# Altium schematic sheet Wifi_Module.SchDoc: Módulo Wifi RN1810
size A4; Author: **; CompanyName: Introducción al Diseño de Circuitos Impresos; Organization: UTN FRBA; DocumentNumber: 6; Revision: 01; SheetNumber: 6; SheetTotal: 9; Autor: Eugenia Ipar
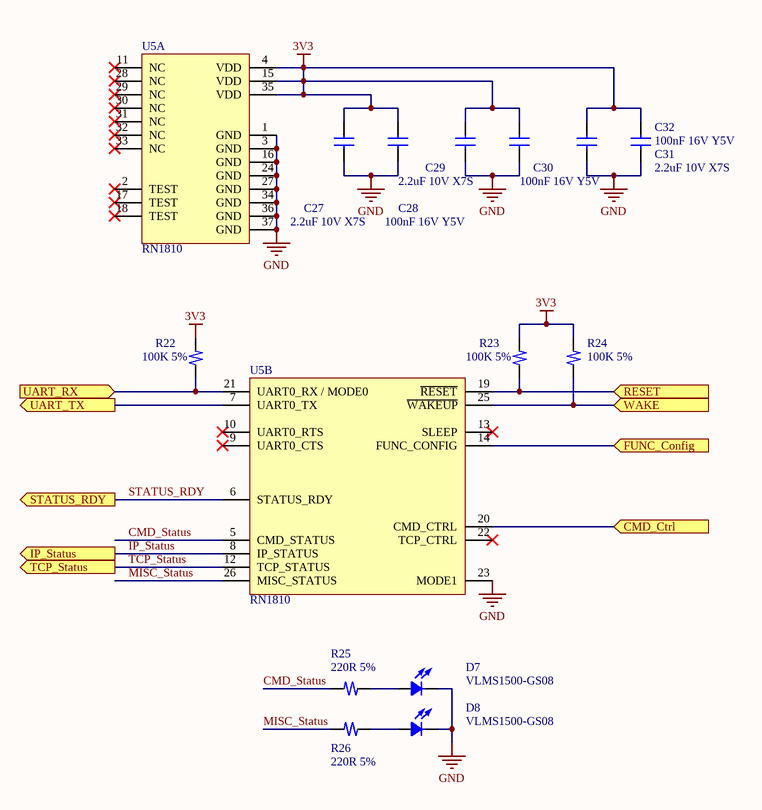
[diagram p0: Wifi_Module.SchDoc]

## Parts
C27  2.2uF 10V X7S  [C_0402]
C28  100nF 16V Y5V  [C_0402]
C29  2.2uF 10V X7S  [C_0402]
C30  100nF 16V Y5V  [C_0402]
C31  2.2uF 10V X7S  [C_0402]
C32  100nF 16V Y5V  [C_0402]
D7  VLMS1500-GS08  [L_0402]
D8  VLMS1500-GS08  [L_0402]
R22  100K 5%  [R_0402]
R23  100K 5%  [R_0402]
R24  100K 5%  [R_0402]
R25  220R 5%  [R_0402]
R26  220R 5%  [R_0402]
U5  RN1810  [RN1810]  (parts A,B of 2)

## Ports
CMD_Ctrl (in), FUNC_Config (in), IP_Status (out), RESET (in), STATUS_RDY (out), TCP_Status (out), UART_RX (in), UART_TX (out), WAKE (in)

## Nets
3V3: C27.1 C28.1 C29.1 C30.1 C31.1 C32.1 R22.2 R23.2 R24.2 U5.4(VDD) U5.15(VDD) U5.35(VDD)
GND: C27.2 C28.2 C29.2 C30.2 C31.2 C32.2 D7.2 D8.2 U5.1(GND) U5.3(GND) U5.16(GND) U5.23(MODE1) U5.24(GND) U5.27(GND) U5.34(GND) U5.36(GND) U5.37(GND)
CMD_Ctrl: U5.20(CMD_CTRL) ; port CMD_Ctrl
CMD_Status: R25.1 U5.5(CMD_STATUS)
FUNC_Config: U5.14(FUNC_CONFIG) ; port FUNC_Config
IP_Status: U5.8(IP_STATUS) ; port IP_Status
MISC_Status: R26.1 U5.26(MISC_STATUS)
RESET: R23.1 U5.19(~{RESET}) ; port RESET
STATUS_RDY: U5.6(STATUS_RDY) ; port STATUS_RDY
TCP_Status: U5.12(TCP_STATUS) ; port TCP_Status
UART_RX: R22.1 U5.21(UART0_RX_/_MODE0) ; port UART_RX
UART_TX: U5.7(UART0_TX) ; port UART_TX
WAKE: R24.1 U5.25(~{WAKEUP}) ; port WAKE
NetD7_1: D7.1 R25.2
NetD8_1: D8.1 R26.2

Not connected (* = marked no-connect by the designer): U5 2(TEST)* 9(UART0_CTS)* 10(UART0_RTS)* 11(NC)* 13(SLEEP)* 17(TEST)* 18(TEST)* 22(TCP_CTRL)* 28(NC)* 29(NC)* 30(NC)* 31(NC)* 32(NC)* 33(NC)*

## Notes on the sheet
- Title:
- Size:
- Author:
- A4
- Sheet
- of
- Revision:
- File:
- Date:

## Library data of the parts
C27-C32 = Ceramic Capacitor: Ceramic Capacitor SMD 0402
D7 D8 = Diode LED: LED Diode SMD 0402
R22-R26 = Resistor: Resistor SMD 0402
U5 = RN1810 Wifi Module: 2.4 GHz IEEE 802.11b/g/n Wireless Module RN1810